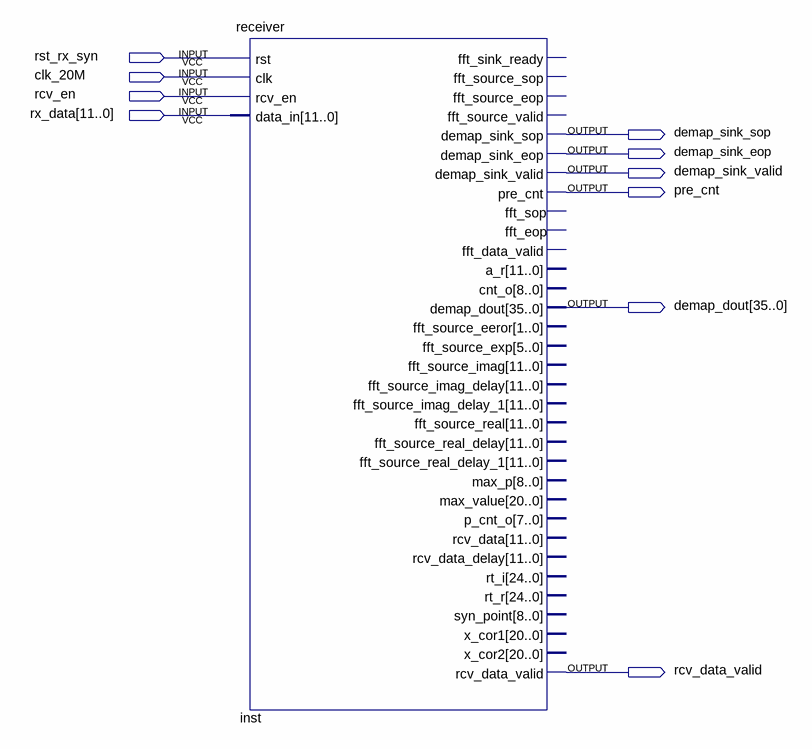
[diagram p0: schematic sheet]
// Quartus schematic rx.bdf as structural Verilog: 1 symbols, 10 pins
module rx (
  input  rst_rx_syn,
  input  clk_20M,
  input  rcv_en,
  input  [11:0] rx_data,
  output demap_sink_sop,
  output demap_sink_eop,
  output demap_sink_valid,
  output pre_cnt,
  output [35:0] demap_dout,
  output rcv_data_valid
);

  receiver inst (
    .rst(rst_rx_syn), .clk(clk_20M), .rcv_en(rcv_en), .data_in(rx_data), .demap_sink_sop(demap_sink_sop),
    .demap_sink_eop(demap_sink_eop), .demap_sink_valid(demap_sink_valid), .pre_cnt(pre_cnt),
    .demap_dout(demap_dout), .rcv_data_valid(rcv_data_valid));  // open: fft_sink_ready, fft_source_sop, fft_source_eop, fft_source_valid, fft_sop, fft_eop, fft_data_valid, a_r, cnt_o, fft_source_eeror, fft_source_exp, fft_source_imag, fft_source_imag_delay, fft_source_imag_delay_1, fft_source_real, fft_source_real_delay, fft_source_real_delay_1, max_p, max_value, p_cnt_o, rcv_data, rcv_data_delay, rt_i, rt_r, syn_point, x_cor1, x_cor2
endmodule
